# Altium schematic sheet RK3576-SMC.SMARC_2 (0021.0 A0).SchDoc
size 420 x 297 mm; Scale: -; DocumentType: Схема электрическая принципиальная; DocumentGOSTLIt1: ㅤ; DocumentGOSTLIt2: ㅤ; DocumentGOSTLIt3: ㅤ; DocumentGOSTNote: Элементы, отмеченные *, используются при трассировке печатной платы, в состав модуля не включаются; SheetNumber: 2; SheetTotal: 6; DocumentTypeShort: Э3; DocumentInvertoryNumber: ㅤ
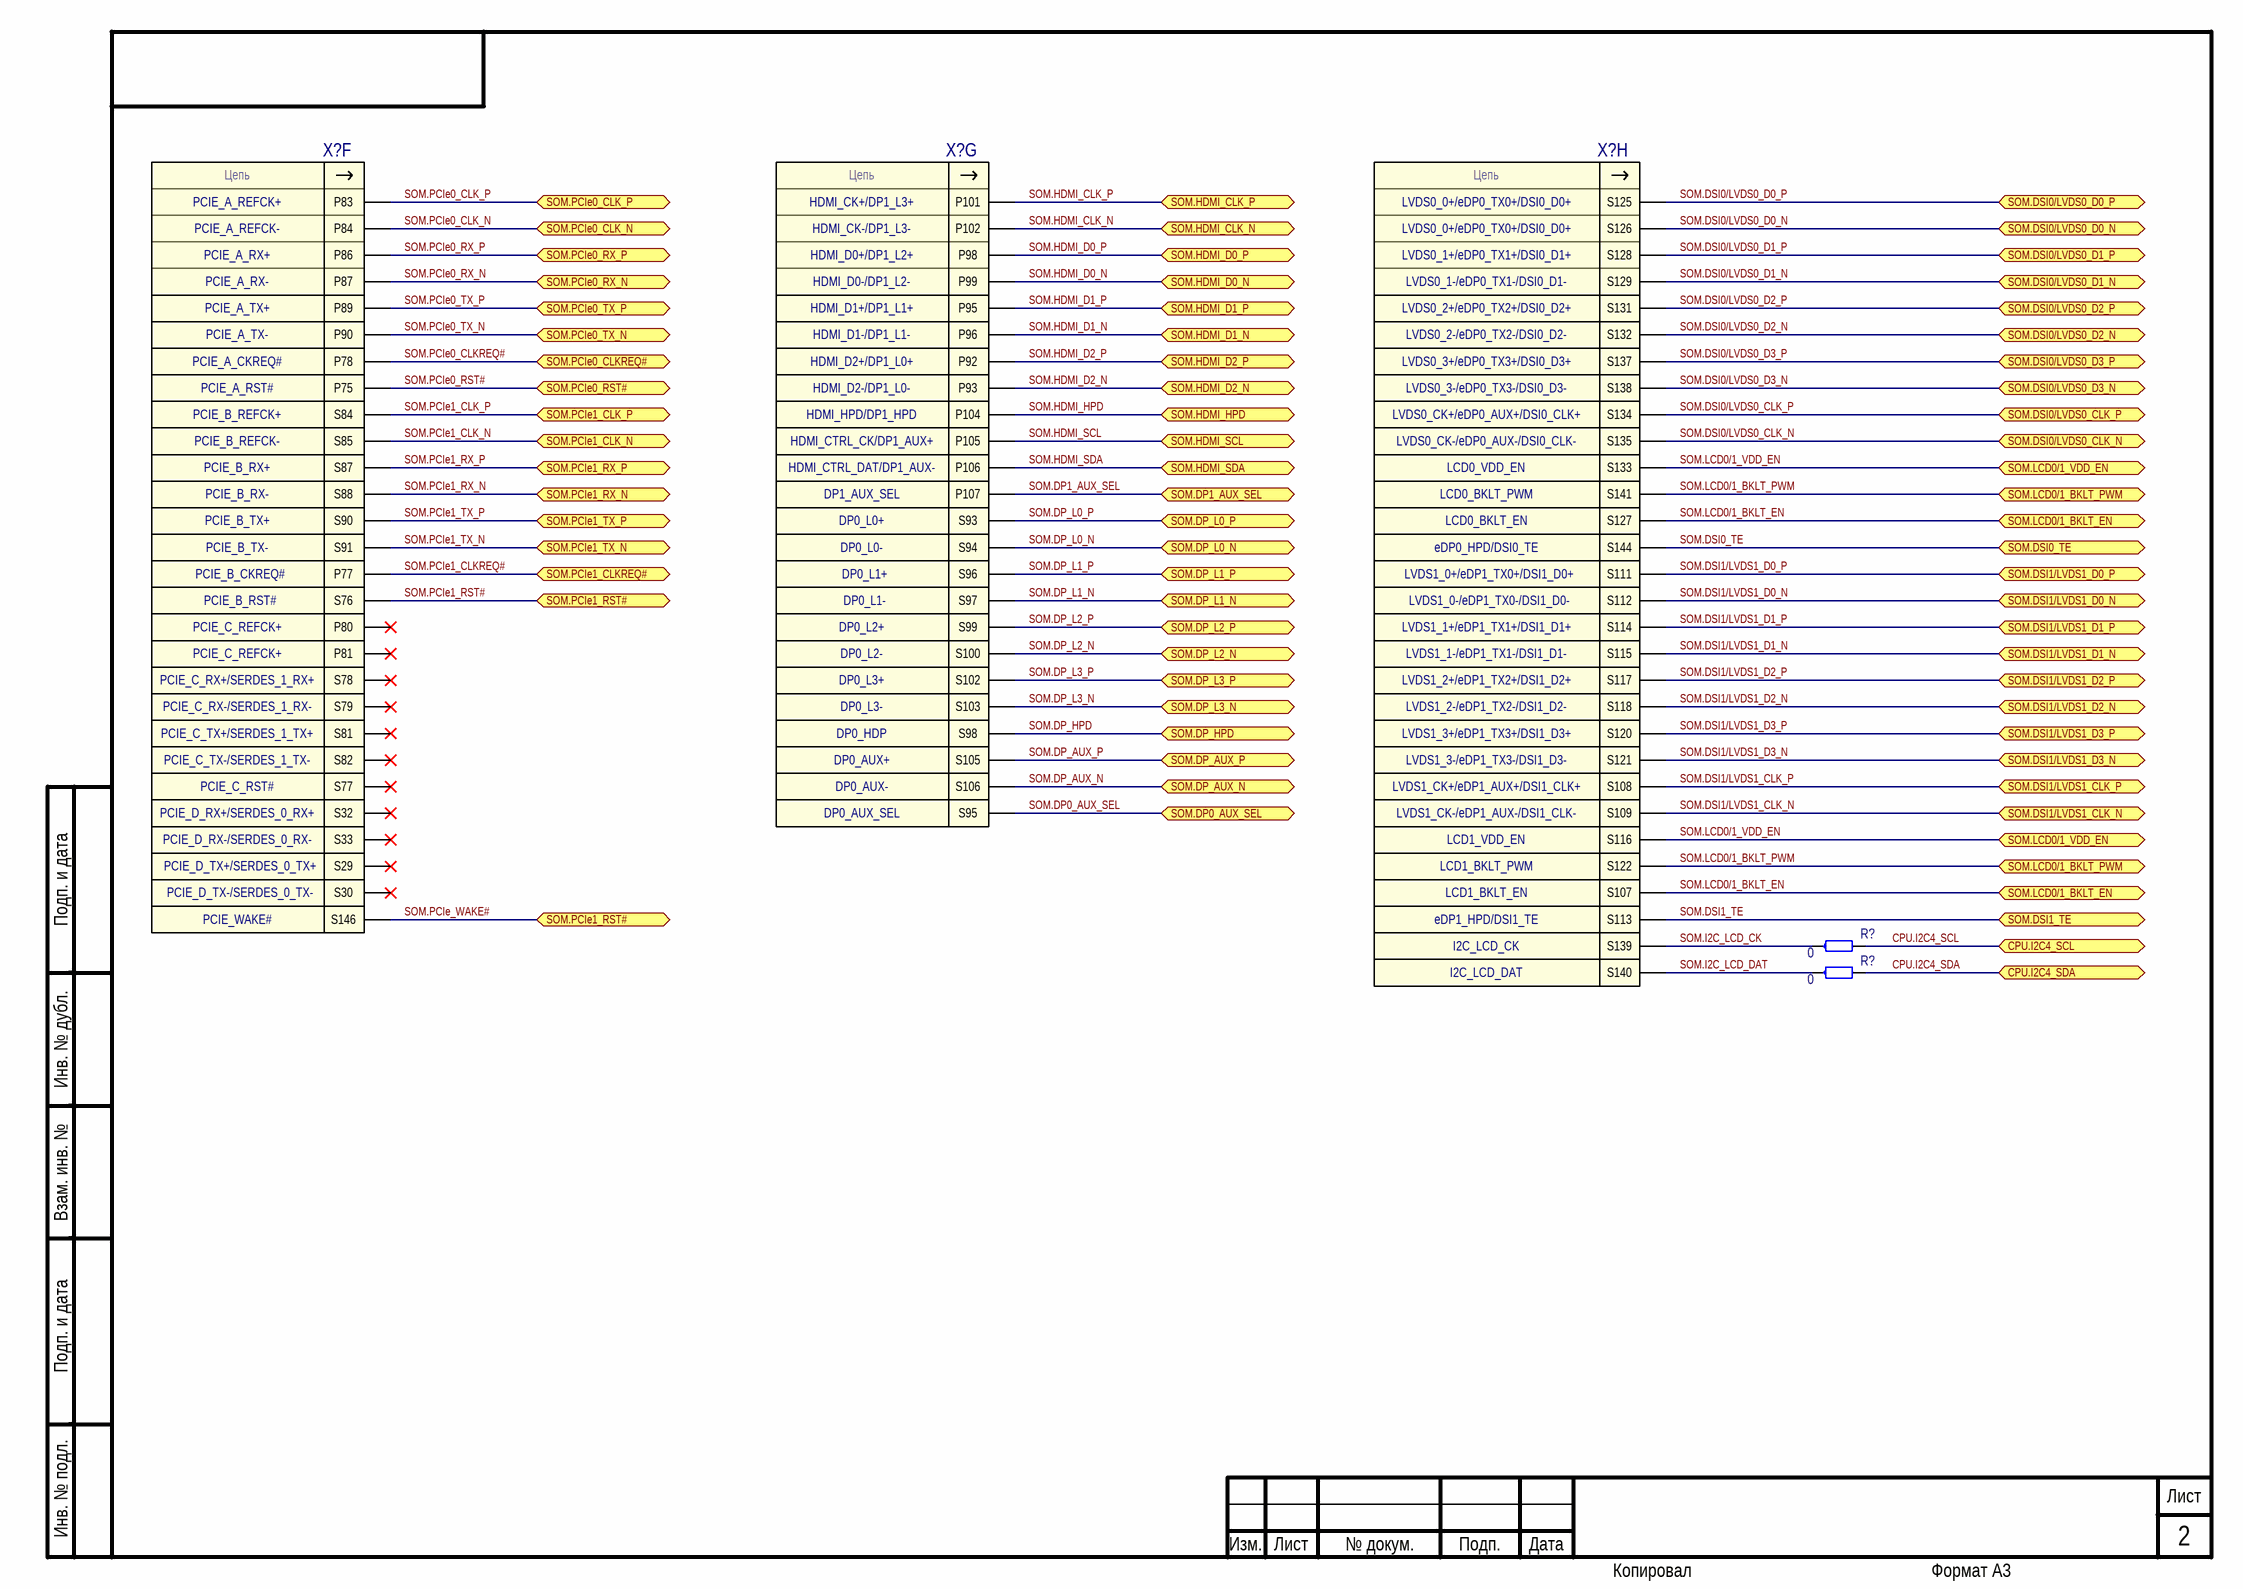
[diagram p0: RK3576-SMC.SMARC_2 (0021.0 A0).SchDoc]

## Parts
(Parts that share a designator on the sheet are numbered #1, #2 ... from top to bottom, then left to right.)
R?#1  0  [resc0603x26n]
R?#2  0  [resc0603x26n]
X?#1  SMARC  [con_smarc]  (value not drawn)  (part F of 13)
X?#2  SMARC  [con_smarc]  (value not drawn)  (part G of 13)
X?#3  SMARC  [con_smarc]  (value not drawn)  (part H of 13)

## Ports
CPU.I2C4_SCL (bidir), CPU.I2C4_SDA (bidir), SOM.DP0_AUX_SEL (bidir), SOM.DP1_AUX_SEL (bidir), SOM.DP_AUX_N (bidir), SOM.DP_AUX_P (bidir), SOM.DP_HPD (bidir), SOM.DP_L0_N (bidir), SOM.DP_L0_P (bidir), SOM.DP_L1_N (bidir), SOM.DP_L1_P (bidir), SOM.DP_L2_N (bidir), SOM.DP_L2_P (bidir), SOM.DP_L3_N (bidir), SOM.DP_L3_P (bidir), SOM.DSI0/LVDS0_CLK_N (bidir), SOM.DSI0/LVDS0_CLK_P (bidir), SOM.DSI0/LVDS0_D0_N (bidir), SOM.DSI0/LVDS0_D0_P (bidir), SOM.DSI0/LVDS0_D1_N (bidir), SOM.DSI0/LVDS0_D1_P (bidir), SOM.DSI0/LVDS0_D2_N (bidir), SOM.DSI0/LVDS0_D2_P (bidir), SOM.DSI0/LVDS0_D3_N (bidir), SOM.DSI0/LVDS0_D3_P (bidir), SOM.DSI0_TE (bidir), SOM.DSI1/LVDS1_CLK_N (bidir), SOM.DSI1/LVDS1_CLK_P (bidir), SOM.DSI1/LVDS1_D0_N (bidir), SOM.DSI1/LVDS1_D0_P (bidir), SOM.DSI1/LVDS1_D1_N (bidir), SOM.DSI1/LVDS1_D1_P (bidir), SOM.DSI1/LVDS1_D2_N (bidir), SOM.DSI1/LVDS1_D2_P (bidir), SOM.DSI1/LVDS1_D3_N (bidir), SOM.DSI1/LVDS1_D3_P (bidir), SOM.DSI1_TE (bidir), SOM.HDMI_CLK_N (bidir), SOM.HDMI_CLK_P (bidir), SOM.HDMI_D0_N (bidir), SOM.HDMI_D0_P (bidir), SOM.HDMI_D1_N (bidir), SOM.HDMI_D1_P (bidir), SOM.HDMI_D2_N (bidir), SOM.HDMI_D2_P (bidir), SOM.HDMI_HPD (bidir), SOM.HDMI_SCL (bidir), SOM.HDMI_SDA (bidir), SOM.LCD0/1_BKLT_EN (bidir), SOM.LCD0/1_BKLT_PWM (bidir), SOM.LCD0/1_VDD_EN (bidir), SOM.PCIe0_CLK_N (bidir), SOM.PCIe0_CLK_P (bidir), SOM.PCIe0_CLKREQ# (bidir), SOM.PCIe0_RST# (bidir), SOM.PCIe0_RX_N (bidir), SOM.PCIe0_RX_P (bidir), SOM.PCIe0_TX_N (bidir), SOM.PCIe0_TX_P (bidir), SOM.PCIe1_CLK_N (bidir), SOM.PCIe1_CLK_P (bidir), SOM.PCIe1_CLKREQ# (bidir), SOM.PCIe1_RST# (bidir), SOM.PCIe1_RX_N (bidir), SOM.PCIe1_RX_P (bidir), SOM.PCIe1_TX_N (bidir), SOM.PCIe1_TX_P (bidir)

## Nets
CPU.I2C4_SCL: R?#1.2 ; port CPU.I2C4_SCL
CPU.I2C4_SDA: R?#2.2 ; port CPU.I2C4_SDA
SOM.DP0_AUX_SEL: X?#2.S95 ; port SOM.DP0_AUX_SEL
SOM.DP1_AUX_SEL: X?#2.P107 ; port SOM.DP1_AUX_SEL
SOM.DP_AUX_N: X?#2.S106 ; port SOM.DP_AUX_N
SOM.DP_AUX_P: X?#2.S105 ; port SOM.DP_AUX_P
SOM.DP_HPD: X?#2.S98 ; port SOM.DP_HPD
SOM.DP_L0_N: X?#2.S94 ; port SOM.DP_L0_N
SOM.DP_L0_P: X?#2.S93 ; port SOM.DP_L0_P
SOM.DP_L1_N: X?#2.S97 ; port SOM.DP_L1_N
SOM.DP_L1_P: X?#2.S96 ; port SOM.DP_L1_P
SOM.DP_L2_N: X?#2.S100 ; port SOM.DP_L2_N
SOM.DP_L2_P: X?#2.S99 ; port SOM.DP_L2_P
SOM.DP_L3_N: X?#2.S103 ; port SOM.DP_L3_N
SOM.DP_L3_P: X?#2.S102 ; port SOM.DP_L3_P
SOM.DSI0/LVDS0_CLK_N: X?#3.S135 ; port SOM.DSI0/LVDS0_CLK_N
SOM.DSI0/LVDS0_CLK_P: X?#3.S134 ; port SOM.DSI0/LVDS0_CLK_P
SOM.DSI0/LVDS0_D0_N: X?#3.S126 ; port SOM.DSI0/LVDS0_D0_N
SOM.DSI0/LVDS0_D0_P: X?#3.S125 ; port SOM.DSI0/LVDS0_D0_P
SOM.DSI0/LVDS0_D1_N: X?#3.S129 ; port SOM.DSI0/LVDS0_D1_N
SOM.DSI0/LVDS0_D1_P: X?#3.S128 ; port SOM.DSI0/LVDS0_D1_P
SOM.DSI0/LVDS0_D2_N: X?#3.S132 ; port SOM.DSI0/LVDS0_D2_N
SOM.DSI0/LVDS0_D2_P: X?#3.S131 ; port SOM.DSI0/LVDS0_D2_P
SOM.DSI0/LVDS0_D3_N: X?#3.S138 ; port SOM.DSI0/LVDS0_D3_N
SOM.DSI0/LVDS0_D3_P: X?#3.S137 ; port SOM.DSI0/LVDS0_D3_P
SOM.DSI0_TE: X?#3.S144 ; port SOM.DSI0_TE
SOM.DSI1/LVDS1_CLK_N: X?#3.S109 ; port SOM.DSI1/LVDS1_CLK_N
SOM.DSI1/LVDS1_CLK_P: X?#3.S108 ; port SOM.DSI1/LVDS1_CLK_P
SOM.DSI1/LVDS1_D0_N: X?#3.S112 ; port SOM.DSI1/LVDS1_D0_N
SOM.DSI1/LVDS1_D0_P: X?#3.S111 ; port SOM.DSI1/LVDS1_D0_P
SOM.DSI1/LVDS1_D1_N: X?#3.S115 ; port SOM.DSI1/LVDS1_D1_N
SOM.DSI1/LVDS1_D1_P: X?#3.S114 ; port SOM.DSI1/LVDS1_D1_P
SOM.DSI1/LVDS1_D2_N: X?#3.S118 ; port SOM.DSI1/LVDS1_D2_N
SOM.DSI1/LVDS1_D2_P: X?#3.S117 ; port SOM.DSI1/LVDS1_D2_P
SOM.DSI1/LVDS1_D3_N: X?#3.S121 ; port SOM.DSI1/LVDS1_D3_N
SOM.DSI1/LVDS1_D3_P: X?#3.S120 ; port SOM.DSI1/LVDS1_D3_P
SOM.DSI1_TE: X?#3.S113 ; port SOM.DSI1_TE
SOM.HDMI_CLK_N: X?#2.P102 ; port SOM.HDMI_CLK_N
SOM.HDMI_CLK_P: X?#2.P101 ; port SOM.HDMI_CLK_P
SOM.HDMI_D0_N: X?#2.P99 ; port SOM.HDMI_D0_N
SOM.HDMI_D0_P: X?#2.P98 ; port SOM.HDMI_D0_P
SOM.HDMI_D1_N: X?#2.P96 ; port SOM.HDMI_D1_N
SOM.HDMI_D1_P: X?#2.P95 ; port SOM.HDMI_D1_P
SOM.HDMI_D2_N: X?#2.P93 ; port SOM.HDMI_D2_N
SOM.HDMI_D2_P: X?#2.P92 ; port SOM.HDMI_D2_P
SOM.HDMI_HPD: X?#2.P104 ; port SOM.HDMI_HPD
SOM.HDMI_SCL: X?#2.P105 ; port SOM.HDMI_SCL
SOM.HDMI_SDA: X?#2.P106 ; port SOM.HDMI_SDA
SOM.I2C_LCD_CK: R?#1.1 X?#3.S139
SOM.I2C_LCD_DAT: R?#2.1 X?#3.S140
SOM.LCD0/1_BKLT_EN: X?#3.S107 X?#3.S127 ; port SOM.LCD0/1_BKLT_EN
SOM.LCD0/1_BKLT_PWM: X?#3.S122 X?#3.S141 ; port SOM.LCD0/1_BKLT_PWM
SOM.LCD0/1_VDD_EN: X?#3.S116 X?#3.S133 ; port SOM.LCD0/1_VDD_EN
SOM.PCIe0_CLK_N: X?#1.P84 ; port SOM.PCIe0_CLK_N
SOM.PCIe0_CLK_P: X?#1.P83 ; port SOM.PCIe0_CLK_P
SOM.PCIe0_CLKREQ#: X?#1.P78 ; port SOM.PCIe0_CLKREQ#
SOM.PCIe0_RST#: X?#1.P75 ; port SOM.PCIe0_RST#
SOM.PCIe0_RX_N: X?#1.P87 ; port SOM.PCIe0_RX_N
SOM.PCIe0_RX_P: X?#1.P86 ; port SOM.PCIe0_RX_P
SOM.PCIe0_TX_N: X?#1.P90 ; port SOM.PCIe0_TX_N
SOM.PCIe0_TX_P: X?#1.P89 ; port SOM.PCIe0_TX_P
SOM.PCIe1_CLK_N: X?#1.S85 ; port SOM.PCIe1_CLK_N
SOM.PCIe1_CLK_P: X?#1.S84 ; port SOM.PCIe1_CLK_P
SOM.PCIe1_CLKREQ#: X?#1.P77 ; port SOM.PCIe1_CLKREQ#
SOM.PCIe1_RST#: X?#1.S76 X?#1.S146 ; port SOM.PCIe1_RST#  [also labelled SOM.PCIe_WAKE#]
SOM.PCIe1_RX_N: X?#1.S88 ; port SOM.PCIe1_RX_N
SOM.PCIe1_RX_P: X?#1.S87 ; port SOM.PCIe1_RX_P
SOM.PCIe1_TX_N: X?#1.S91 ; port SOM.PCIe1_TX_N
SOM.PCIe1_TX_P: X?#1.S90 ; port SOM.PCIe1_TX_P

Not connected (* = marked no-connect by the designer): X?#1 P80* P81* S29* S30* S32* S33* S77* S78* S79* S81* S82*

## Notes on the sheet
- Подп. и дата
- Инв. № дубл.
- Взам. инв. №
- Инв. № подл.
- Изм.
- Лист
- № докум.
- Подп.
- Дата
- Копировал
- Формат А3
- (in symbol SMARC, part F) Цепь; PCIE_A_REFCK+; PCIE_A_REFCK-; PCIE_A_RX+; PCIE_A_RX-; PCIE_A_TX+; PCIE_A_TX-; PCIE_A_CKREQ#; PCIE_A_RST#; PCIE_B_REFCK+; PCIE_B_REFCK-; PCIE_B_RX+; PCIE_B_RX-; PCIE_B_TX+; PCIE_B_TX-; PCIE_B_CKREQ#; PCIE_B_RST#; PCIE_C_REFCK+; PCIE_C_RX+/SERDES_1_RX+; PCIE_C_RX-/SERDES_1_RX-; PCIE_C_TX+/SERDES_1_TX+; PCIE_C_TX-/SERDES_1_TX-; PCIE_C_RST#; PCIE_D_RX+/SERDES_0_RX+; PCIE_D_RX-/SERDES_0_RX-; PCIE_D_TX+/SERDES_0_TX+; PCIE_D_TX-/SERDES_0_TX-; PCIE_WAKE#
- (in symbol SMARC, part G) Цепь; HDMI_CK+/DP1_L3+; HDMI_CK-/DP1_L3-; HDMI_D0+/DP1_L2+; HDMI_D0-/DP1_L2-; HDMI_D1+/DP1_L1+; HDMI_D1-/DP1_L1-; HDMI_D2+/DP1_L0+; HDMI_D2-/DP1_L0-; HDMI_HPD/DP1_HPD; HDMI_CTRL_CK/DP1_AUX+; HDMI_CTRL_DAT/DP1_AUX-; DP1_AUX_SEL; DP0_L0+; DP0_L0-; DP0_L1+; DP0_L1-; DP0_L2+; DP0_L2-; DP0_L3+; DP0_L3-; DP0_HDP; DP0_AUX+; DP0_AUX-; DP0_AUX_SEL
- (in symbol SMARC, part H) Цепь; LVDS0_0+/eDP0_TX0+/DSI0_D0+; LVDS0_1+/eDP0_TX1+/DSI0_D1+; LVDS0_1-/eDP0_TX1-/DSI0_D1-; LVDS0_2+/eDP0_TX2+/DSI0_D2+; LVDS0_2-/eDP0_TX2-/DSI0_D2-; LVDS0_3+/eDP0_TX3+/DSI0_D3+; LVDS0_3-/eDP0_TX3-/DSI0_D3-; LVDS0_CK+/eDP0_AUX+/DSI0_CLK+; LVDS0_CK-/eDP0_AUX-/DSI0_CLK-; LCD0_VDD_EN; LCD0_BKLT_PWM; LCD0_BKLT_EN; eDP0_HPD/DSI0_TE; LVDS1_0+/eDP1_TX0+/DSI1_D0+; LVDS1_0-/eDP1_TX0-/DSI1_D0-; LVDS1_1+/eDP1_TX1+/DSI1_D1+; LVDS1_1-/eDP1_TX1-/DSI1_D1-; LVDS1_2+/eDP1_TX2+/DSI1_D2+; LVDS1_2-/eDP1_TX2-/DSI1_D2-; LVDS1_3+/eDP1_TX3+/DSI1_D3+; LVDS1_3-/eDP1_TX3-/DSI1_D3-; LVDS1_CK+/eDP1_AUX+/DSI1_CLK+; LVDS1_CK-/eDP1_AUX-/DSI1_CLK-; LCD1_VDD_EN; LCD1_BKLT_PWM; LCD1_BKLT_EN; eDP1_HPD/DSI1_TE; I2C_LCD_CK; I2C_LCD_DAT

## Library data of the parts
R?#1 R?#2 = RC0201JR-070RL: Резисторы (chip) общего назначения; Part_ID: ATB-09733; Manufacturer: Yageo; Schematic_Part: R_min_val,R_min,R_val,R; Наименование: 0201-0.05W-0±5%; Voltage: 30V; Power: 0.05; Точность: ±5%; Температура: -55 +125; Вариант установки: Поверхностный; Код ERP: E2-00008416; Photo: Photos\Photos\Yageo_RC0075-RC2512.jpg; Автор: Чепиков И.В.; Device: 0201-0.05W-0±5%_Yageo; Library Ref 2: R; Part Number: RC0201JR-070RL; Тип ЭКБ: Резисторы; Datasheet: Datasheets\Resistors\PYu-RC_Group_51_RoHS_L_12.pdf; Тип компонента: Резистор; Номинал: 0; Value: 0; Part_Number: RC0201JR-070RL; PCB_Footprint: resc0603x26n; Тип корпуса: Chip; Height: 0.26; Производитель: Yageo; Website: https://www.yageo.com/upload/media/product/products/datasheet/rchip/PYu-RC_Group_51_RoHS_L_12.pdf; Дата: 14.01.2025; NameFromManufacturer: RC0201JR-070RL; ComponentLink1URL: https://www.yageo.com/upload/media/product/products/datasheet/rchip/PYu-RC_Group_51_RoHS_L_12.pdf; ComponentLink1Description: PYu-RC_Group_51_RoHS_L_12.pdf; Original PN: RC0201JR-070RL
X?#1-X?#3 = SMARC: Краевой разъем SMARC_V2.1, Smarc_v2.2, 314 конт.; Part_ID: ATB-00378; Manufacturer: SMARC 2.1 Specification; Schematic_Part: SMARC_v2_1_XP,SMARCV22XP; Тип ЭКБ: Соединители; Тип компонента: Вилка Краевой Smarc; Photo: Photos\Photos\SMARC.jpg; Автор: Чепиков И.В.; Library Ref 2: SMARCV22XP; Part Number: SMARC; Наименование: SMARC; Datasheet: Datasheets\Connectors\SMARC_V21-specification.pdf,SMARC_V22_Specification.pdf; Value: SMARC; Part_Number: SMARC; PCB_Footprint: con_smarc; Website: https://www.isee.biz/images/Manuals/smarc/SMARC_Hardware_Specification_V211.pdf; Дата: 01.07.2024; Device: SMARC; NameFromManufacturer: SMARC; ComponentLink1URL: https://www.isee.biz/images/Manuals/smarc/SMARC_Hardware_Specification_V211.pdf; ComponentLink1Description: SMARC_V21-specification.pdf,SMARC_V22_Specification.pdf; Original PN: SMARC